# EAGLE design Wio_MB128_Test_rev_A (EAGLE 9.6.2)
PC Engine Joypad Breakout Version 1.0
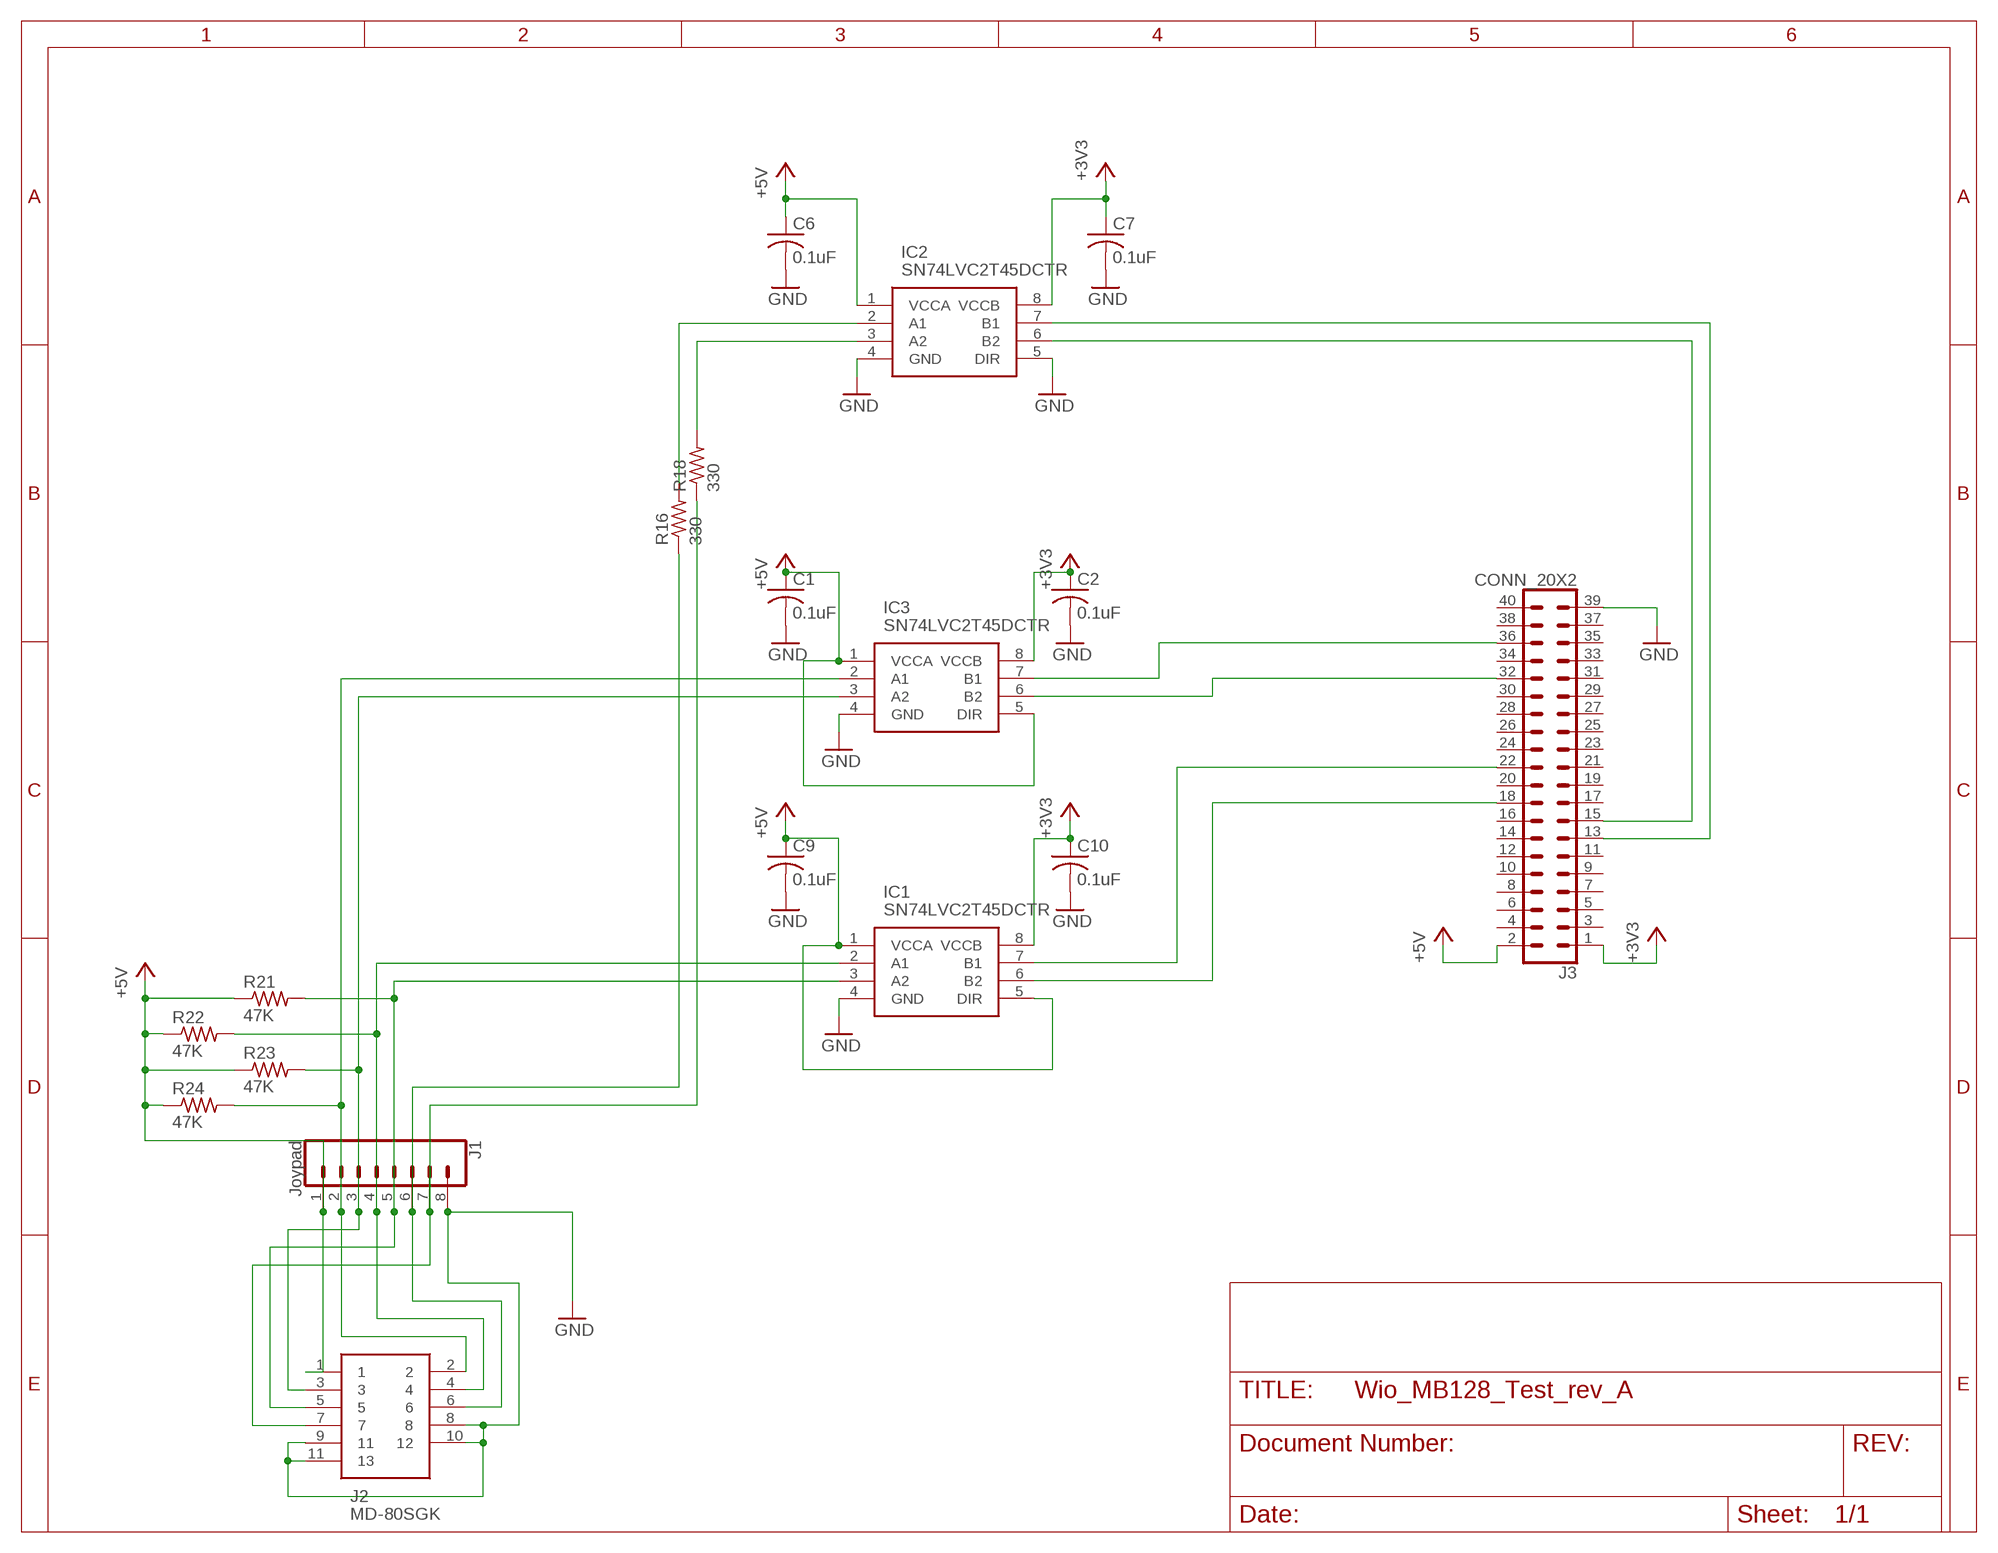
[diagram p0: schematic, sheet 1]

## Parts
C1  0.1uF  C-USC0603  [C0603]
C2  0.1uF  C-USC0603  [C0603]
C6  0.1uF  C-USC0603  [C0603]
C7  0.1uF  C-USC0603  [C0603]
C9  0.1uF  C-USC0603  [C0603]
C10  0.1uF  C-USC0603  [C0603]
IC1  SN74LVC2T45DCTR  [SOP65P400X130-8N]
IC2  SN74LVC2T45DCTR  [SOP65P400X130-8N]
IC3  SN74LVC2T45DCTR  [SOP65P400X130-8N]
J1  Joypad  CONN_08"  [1X08]
J2  MD-80SGK  [MD80SGK]
J3  CONN_20X2  [2X20]
R16  330  R-US_R0603  [R0603]
R18  330  R-US_R0603  [R0603]
R21  47K  R-US_R0603  [R0603]
R22  47K  R-US_R0603  [R0603]
R23  47K  R-US_R0603  [R0603]
R24  47K  R-US_R0603  [R0603]

## Nets
+3V3 [power]: C2.1 C7.1 C10.1 IC1.8(VCCB) IC2.8(VCCB) IC3.8(VCCB) J3.1
+5V [power]: C1.1 C6.1 C9.1 IC1.1(VCCA) IC1.5(DIR) IC2.1(VCCA) IC3.1(VCCA) IC3.5(DIR) J1.1 J2.1 J3.2 R21.1 R22.1 R23.1 R24.1
CLR [signal]: J1.7 J2.7 R18.1
D11 [signal]: IC1.7(B1) J3.22
GND: C1.2 C2.2 C6.2 C7.2 C9.2 C10.2 IC1.4(GND) IC2.4(GND) IC2.5(DIR) IC3.4(GND) J1.8 J2.8 J2.9 J2.10 J2.11 J3.39
N$1: IC2.7(B1) J3.13
N$2 [signal]: IC3.3(A2) J1.3 J2.3 R23.2
N$3 [signal]: IC3.2(A1) J1.2 J2.2 R24.2
N$4: IC2.6(B2) J3.15
N$8: IC1.6(B2) J3.18
N$13 [signal]: IC2.2(A1) R16.2
N$16: IC1.2(A1) J1.4 J2.4 R22.2
N$18: IC1.3(A2) J1.5 J2.5 R21.2
N$21 [signal]: IC2.3(A2) R18.2
N$33: IC3.7(B1) J3.36
N$34: IC3.6(B2) J3.32
SEL [signal]: J1.6 J2.6 R16.1
Unconnected: J3.3 J3.4 J3.5 J3.6 J3.7 J3.8 J3.9 J3.10 J3.11 J3.12 J3.14 J3.16 J3.17 J3.19 J3.20 J3.21 J3.23 J3.24 J3.25 J3.26 J3.27 J3.28 J3.29 J3.30 J3.31 J3.33 J3.34 J3.35 J3.37 J3.38 J3.40

## Library data of the parts
C1 C2 C6 C7 C9 C10 = resistor:C-US: CAPACITOR, American symbol
IC1-IC3 = SamacSys_Parts:SN74LVC2T45DCTR: 2-Bit Bus Transceiver, Translation SSOP8 SN74LVC2T45DCTR, Voltage Level Translator, Bus Transceiver LVC, 3-State 1.65 Source: Datasheet <http://www.ti.com/lit/ds/symlink/sn74lvc2t45.pdf>; DESCRIPTION: 2-Bit Bus Transceiver, Translation SSOP8 SN74LVC2T45DCTR, Voltage Level Translator, Bus Transceiver LVC, 3-State 1.65; HEIGHT: 1.3mm; MANUFACTURER_NAME: Texas Instruments; MANUFACTURER_PART_NUMBER: SN74LVC2T45DCTR; MOUSER_PART_NUMBER: 595-SN74LVC2T45DCTR; MOUSER_PRICE-STOCK: https://www.mouser.com/Search/Refine.aspx?Keyword=595-SN74LVC2T45DCTR; RS_PART_NUMBER: 9213022; RS_PRICE-STOCK: http://uk.rs-online.com/web/p/products/9213022
J1 = SparkFun-Connectors:CONN_08: Multi connection point. Often used as Generic Header-pin footprint for 0.1 inch spaced/style header connections On any of the 0.1 inch spaced packages, you can populate with these: Break Away Headers - Straight <https://www.sparkfun.com/products/116> (PRT-00116) Break Away Male Headers - Right Angle <https://www.sparkfun.com/products/553> (PRT-00553) Female Headers <https://www.sparkfun.com/products/115> (PRT-00115) Break Away Headers - Machine Pin <https://www.sparkfun.com/products/117> (PRT-00117) Break Away Female Headers - Swiss Machine Pin <https://www.sparkfun.com/products/743> (PRT-00743) Arduino Stackable Header - 8 Pin <https://www.sparkfun.com/products/9279> (PRT-09279) For SCREWTERMINALS and SPRING TERMINALS visit here: Screw Terimnals on SparkFun.com <https://www.sparkfun.com/search/results?term=Screw+Terminals> (5mm/3.5mm/2.54mm spacing) This device is also useful as a general connection point to wire up your design to another part of your project. Our various solder wires solder well into these plated through hole pads. Hook-Up Wire - Assortment (Stranded, 22 AWG) <https://www.sparkfun.com/products/11375> (PRT-11375) Hook-Up Wire - Assortment (Solid Core, 22 AWG) <https://www.sparkfun.com/products/11367> (PRT-11367) View the entire wire category on our website here <https://www.sparkfun.com/categories/141> Special notes: Molex polarized connector foot print use with SKU : PRT-08231 with associated crimp pins and housings. 1MM SMD Version SKU: PRT-10208 NOTES ON THE VARIANTS LOCK and LOCK_LONGPADS... This footprint was designed to help hold the alignment of a through-hole component (i.e. 6-pin header) while soldering it into place. You may notice that each hole has been shifted either up or down by 0.005 of an inch from it's more standard position (which is a perfectly straight line). This slight alteration caused the pins (the squares in the middle) to touch the edges of the holes. Because they are alternating, it causes a "brace" to hold the component in place. 0.005 has proven to be the perfect amount of "off-center" position when using our standard breakaway headers. Although looks a little odd when you look at the bare footprint, once you have a header in there, the alteration is very hard to notice. Also,if you push a header all the way into place, it is covered up entirely on the bottom side.; PROD_ID: CONN-08438
J2 = SamacSys_Parts:MD-80SGK: Circular DIN Connectors mini-DIN, 8P jack, rt, through hole, full shield Source: Datasheet <https://www.cui.com/product/resource/md-sgk-series.pdf>; DESCRIPTION: Circular DIN Connectors mini-DIN, 8P jack, rt, through hole, full shield; HEIGHT: 13mm; MANUFACTURER_NAME: CUI; MANUFACTURER_PART_NUMBER: MD-80SGK; MOUSER_PART_NUMBER: 490-MD-80SGK; MOUSER_PRICE-STOCK: https://www.mouser.com/Search/Refine.aspx?Keyword=490-MD-80SGK
J3 = SparkFun-Connectors:CONN_20X2: Multi connection point. Often used as Generic Header-pin footprint for 0.1 inch spaced/style header connections On any of the 0.1 inch spaced packages, you can populate with these: Break Away Headers - Straight <https://www.sparkfun.com/products/116> (PRT-00116) Break Away Male Headers - Right Angle <https://www.sparkfun.com/products/553> (PRT-00553) Female Headers <https://www.sparkfun.com/products/115> (PRT-00115) Break Away Headers - Machine Pin <https://www.sparkfun.com/products/117> (PRT-00117) Break Away Female Headers - Swiss Machine Pin <https://www.sparkfun.com/products/743> (PRT-00743)
R16 R18 R21-R24 = resistor:R-US_: RESISTOR, American symbol

## Net classes
0 default: width 0.152 mm, drill 0.356 mm, clearance 0.152 mm
1 power: width 0.305 mm, drill 0.356 mm, clearance 0.152 mm
2 signal: width 0.152 mm, drill 0.356 mm, clearance 0.152 mm

## Board
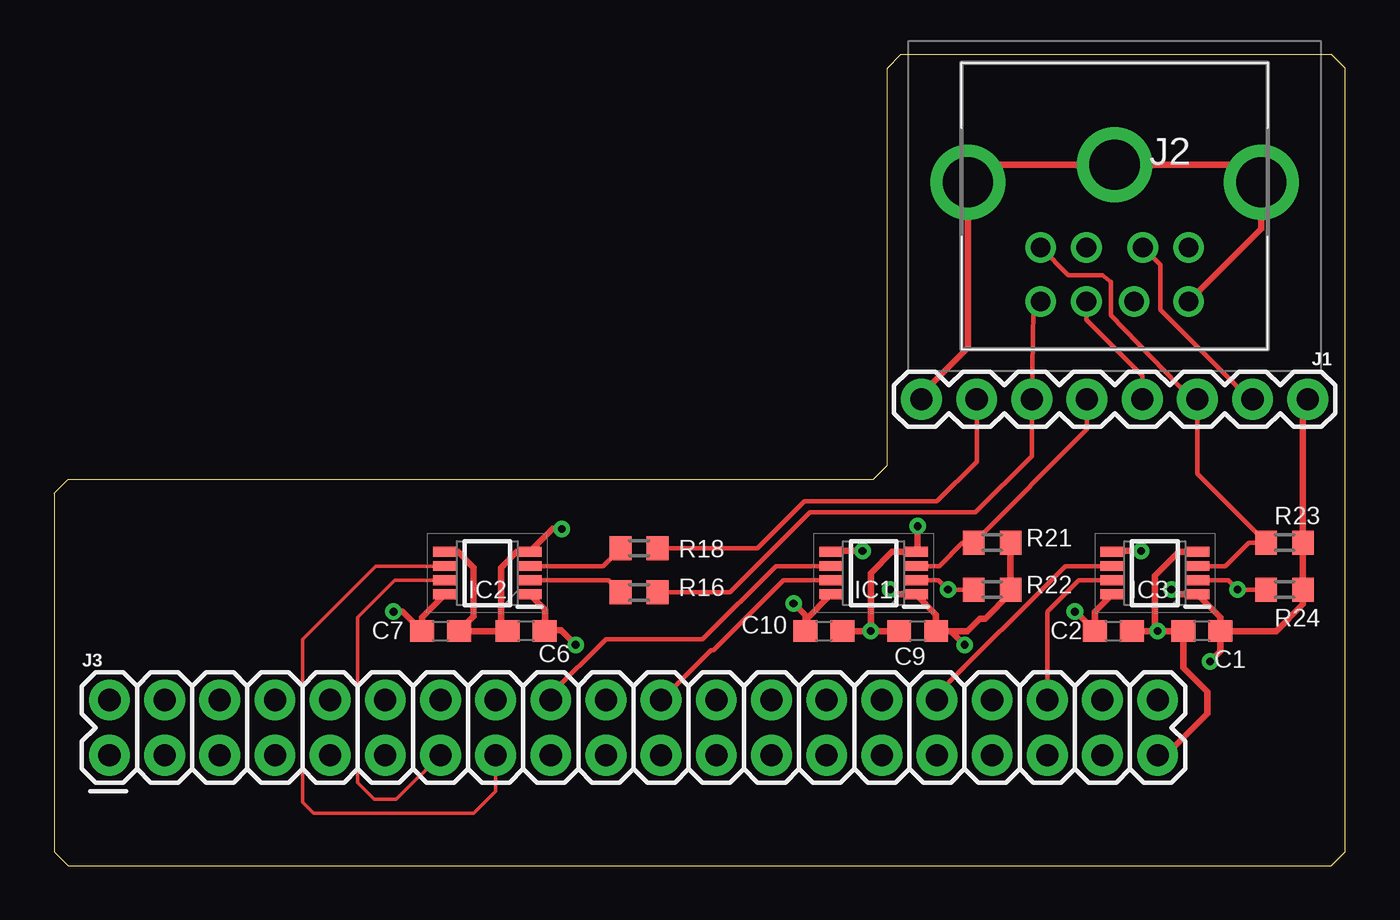
[diagram p1: board, top side]
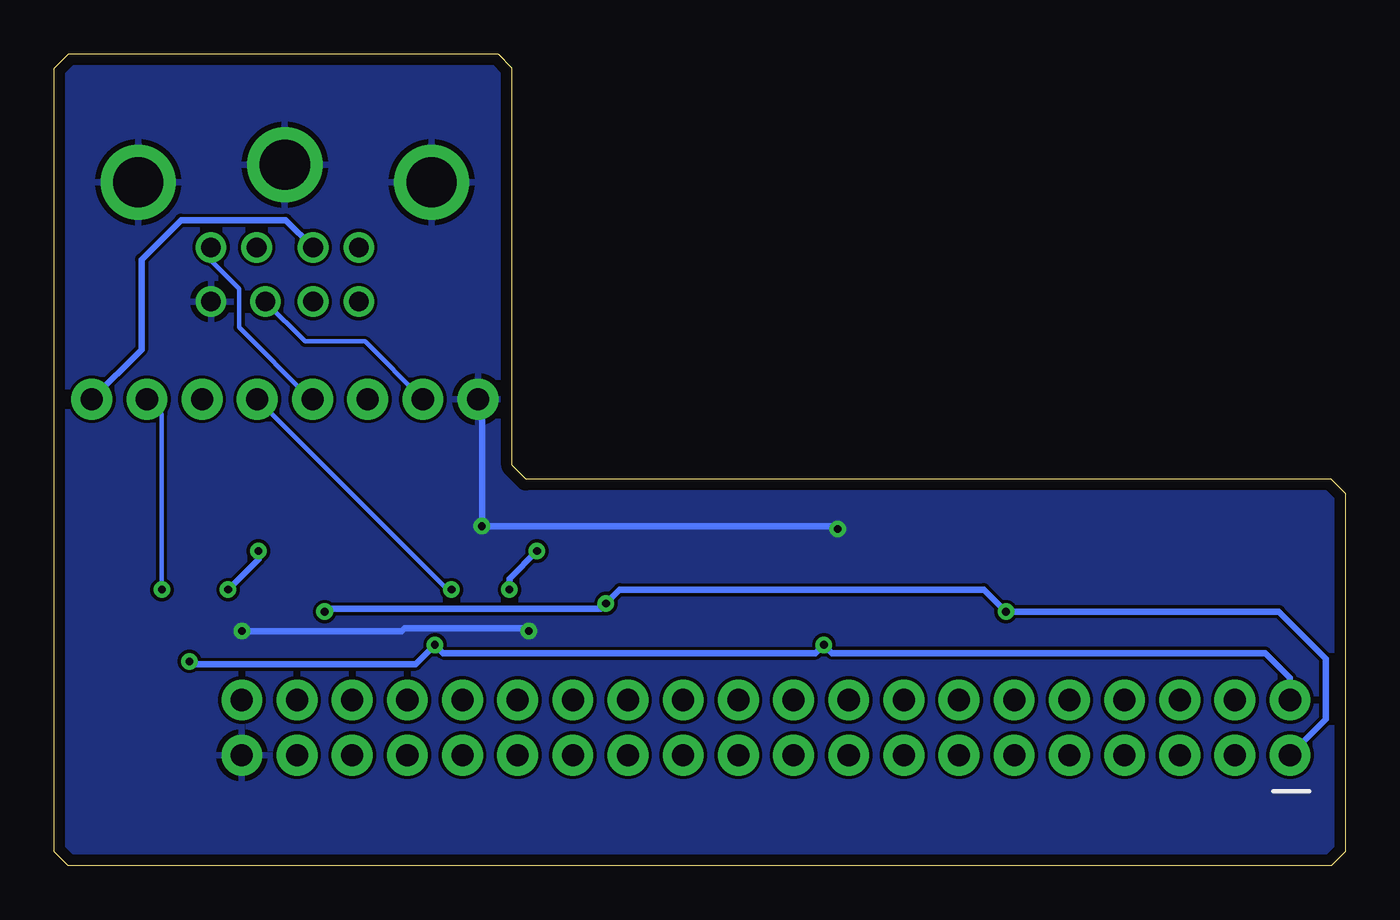
[diagram p2: board, bottom side, seen from below]

Size 59.44 x 37.34 mm. Coordinates in mm from the lower left corner, seen from the top.
Outline: 0.64,0 58.8,0 59.44,0.64 59.44,36.7 58.8,37.34 38.99,37.34 38.35,36.7 38.35,18.41 37.72,17.78 0.64,17.78 0,17.14 0,0.64 0.64,0
Copper layers (1*16): Top 0.035mm / dielectric 1.5mm / Bottom 0.035mm
Design rules "default *": minimum track width 6mil, minimum drill 0.35mm, track to track 6mil, track to pad 6mil, pad to pad 6mil, via to via 6mil, smd to smd 6mil, copper to edge 20mil, drill to drill 6mil, minimum pad ring 10mil, minimum via ring 8mil, stop-mask expansion 3mil, vias tented up to drill 0mil, thermal gap 10mil

### Footprints (pad centres in the part's own frame; a part is rotated, then mirrored left to right if it is on the bottom)
C0603 = smd 1.1 x 1: 1 -0.85,0; 2 0.85,0
SOP65P400X130-8N = smd 1.1 x 0.45: 1 -1.95,0.975; 2 -1.95,0.325; 3 -1.95,-0.325; 4 -1.95,-0.975; 5 1.95,-0.975; 6 1.95,-0.325; 7 1.95,0.325; 8 1.95,0.975
1X08 = drill 1.016 pad 1.88: 1 0,0; 2 2.54,0; 3 5.08,0; 4 7.62,0; 5 10.16,0; 6 12.7,0; 7 15.24,0; 8 17.78,0
MD80SGK = drill 0.9 pad 1.4: 1 -1.3,-1.9; 2 1.3,-1.9; 3 -3.4,-1.9; 4 -1.3,-4.4; 5 3.4,-1.9; 6 -3.4,-4.4; 7 0.9,-4.4; 8 3.4,-4.4 | drill 2.309 pad 3.463: 9 0,1.9; 10 -6.75,1.1; 11 6.75,1.1
2X20 = drill 1.016 pad 1.88: 1 0,0; 2 0,2.54; 3 2.54,0; 4 2.54,2.54; 5 5.08,0; 6 5.08,2.54; 7 7.62,0; 8 7.62,2.54; 9 10.16,0; 10 10.16,2.54; 11 12.7,0; 12 12.7,2.54; 13 15.24,0; 14 15.24,2.54; 15 17.78,0; 16 17.78,2.54; 17 20.32,0; 18 20.32,2.54; 19 22.86,0; 20 22.86,2.54; 21 25.4,0; 22 25.4,2.54; 23 27.94,0; 24 27.94,2.54; 25 30.48,0; 26 30.48,2.54; 27 33.02,0; 28 33.02,2.54; 29 35.56,0; 30 35.56,2.54; 31 38.1,0; 32 38.1,2.54; 33 40.64,0; 34 40.64,2.54; 35 43.18,0; 36 43.18,2.54; 37 45.72,0; 38 45.72,2.54; 39 48.26,0; 40 48.26,2.54
R0603 = smd 1 x 1.1: 1 -0.85,0; 2 0.85,0

### Placement (x,y rotation side)
C1  52.83,10.79 180 top
C2  48.77,10.79 0 top
C6  21.72,10.79 180 top
C7  17.78,10.79 0 top
C9  39.75,10.79 180 top
C10  35.43,10.79 0 top
IC1  37.72,13.46 180 top
IC2  19.94,13.46 180 top
IC3  50.67,13.46 180 top
J1  57.71,21.46 180 top
J2  48.82,30.35 0 top
J3  2.54,5.08 0 top
R16  26.92,12.57 180 top
R18  26.92,14.61 180 top
R21  43.18,14.86 180 top
R22  43.18,12.7 180 top
R23  56.64,14.86 180 top
R24  56.64,12.7 180 top

### Tracks (layer width: path | path; a pad name or v marks a point on that pad's centre or on a via)
+3V3  (via drill 0.36)
  Top 0.305: IC1.8 34.58,11.3 C10.1 34.58,11.52 v34.04,12.06 | IC3.8 47.92,11.68 C2.1 47.03,11.68 v46.99,11.68 | IC2.8 16.93,11.43 C7.1 16.04,11.68 v15.62,11.68
  Bottom 0.305: J3.1 0.89,6.73 0.89,9.53 3.05,11.68 v15.62,11.68 16.64,12.7 33.4,12.7 v34.04,12.06 34.29,11.81 46.86,11.81 v46.99,11.68
+5V  (via drill 0.36)
  Top 0.305: J1.1 57.49,21.25 R23.1 R24.1 57.49,12.03 56.26,10.79 C1.1 | C1.1 53.68,11.43 IC3.1 51.65,12.49 v51.44,12.7 | C9.1 40.6,11.55 IC1.1 38.69,12.49 v38.48,12.7 | IC2.1 22.61,11.77 22.61,10.83 | 22.61,10.83 C6.1 | C9.1 42.04,10.79 42.61,11.37 42.86,11.37 44.03,12.53 R22.1 R21.1 | v24,10.16 23.33,10.83 22.61,10.83 | v53.21,9.4 53.68,9.87 C1.1 | v41.91,10.16 41.27,10.79 C9.1 | IC3.5 48.76,14.48 v50.04,14.48 | v37.21,14.48 35.81,14.48 IC1.5
  Bottom 0.305: J1.1 55.42,23.75 55.42,27.89 53.6,29.71 48.77,29.71 J2.1 | J3.2 2.54,8.64 3.68,9.78 23.62,9.78 v24,10.16 24.38,9.78 41.53,9.78 v41.91,10.16 42.8,9.27 53.09,9.27 v53.21,9.4 | v51.44,12.7 50.04,14.1 v50.04,14.48 | v38.48,12.7 38.48,13.21 v37.21,14.48
CLR
  Top 0.203: R18.1 32.38,14.61 34.54,16.76 40.64,16.76 42.47,18.59 J1.7
  Bottom 0.203: J2.7 47.9,24.13 45.14,24.13 J1.7
D11
  Top 0.203: J3.22 30.23,9.91 30.35,9.91 33.58,13.14 IC1.7
GND  (via drill 0.36)
  Top 0.305: J1.8 39.93,21.69 42.07,23.83 J2.10 42.87,32.25 J2.9 54.77,32.25 J2.11 55.57,29.3 J2.8 | IC3.4 51.77,14.44 50.67,13.34 50.67,10.92 v50.8,10.79 | v23.37,15.49 22.95,15.49 IC2.4 21.3,14.44 20.57,13.72 20.57,11.09 C6.2 C7.2 19.3,11.47 19.3,13.72 18.58,14.44 IC2.5 | v39.75,15.62 39.75,14.52 IC1.4 38.57,14.44 37.59,13.46 v37.59,10.79 | J3.39 51.18,5.08 53.09,6.99 53.09,8 51.98,9.11 C1.2 v50.8,10.79 | v50.8,10.79 C2.2 | v37.59,10.79 C9.2 | v37.59,10.79 C10.2
  Bottom 0.305: J1.8 39.75,21.29 v39.75,15.62 23.5,15.62 v23.37,15.49 | v50.8,10.79 43.43,10.79 43.31,10.92 37.72,10.92 v37.59,10.79
  pour Bottom: -0.51,-0.51 -0.51,38.1 59.94,38.1 59.94,-0.51
N$1
  Top 0.152: J3.13 15.75,3.05 14.73,3.05 13.97,3.81 13.97,11.43 15.68,13.14 IC2.7
N$2
  Top 0.203: J2.3 46.69,27.18 48.26,27.18 48.64,26.87 48.64,25.33 52.38,21.46 J1.3 52.63,18.02 R23.2 54.99,14.86 53.92,13.79 IC3.3
N$3  (via drill 0.36)
  Top 0.203: J2.2 50.93,27.64 50.93,25.58 55.04,21.46 J1.2 | IC3.2 54.05,13.14 v54.48,12.7 R24.2
  Bottom 0.203: v54.48,12.7 54.48,20.78 J1.2
N$4
  Top 0.152: J3.15 20.32,3.43 19.3,2.41 11.94,2.41 11.43,2.92 11.43,10.41 14.8,13.79 IC2.6
N$8
  Top 0.203: J3.18 22.86,7.87 25.4,10.41 29.84,10.41 33.22,13.79 IC1.6
N$13
  Top 0.203: IC2.2 25.51,13.14 R16.2
N$16  (via drill 0.36)
  Top 0.203: J2.4 47.52,25.12 50.09,22.55 J1.4 | IC1.2 40.71,13.14 v41.15,12.7 R22.2
  Bottom 0.203: J1.4 41.33,12.7 v41.15,12.7
N$18
  Top 0.203: IC1.3 40.75,13.79 41.82,14.86 R21.2 47.55,20.08 J1.5
  Bottom 0.203: J2.5 52.22,27.84 50.93,26.54 50.93,24.77 47.62,21.46 J1.5
N$21
  Top 0.203: IC2.3 25.26,13.79 R18.2
N$33
  Top 0.203: J3.36 45.72,11.68 47.17,13.14 IC3.7
N$34
  Top 0.203: J3.32 40.64,7.87 46.55,13.79 IC3.6
SEL
  Top 0.203: J2.6 45.08,25.61 J1.6 45.01,18.85 42.42,16.26 34.8,16.26 31.11,12.57 R16.1

### Text on the board
tValues: D3 | D2 | D1 | D0 | GND | CLR | SEL | +5V | Mem128 Wio, rev. A | (C)2020 David Shadoff